# EasyEDA schematic display_board_schematic.json
TITLE: Sheet_1; REV: 1.0; Date: 2021-11-24; Sheet: 1/1; Drawn By: Gustavo Moraes; Company: Your Company
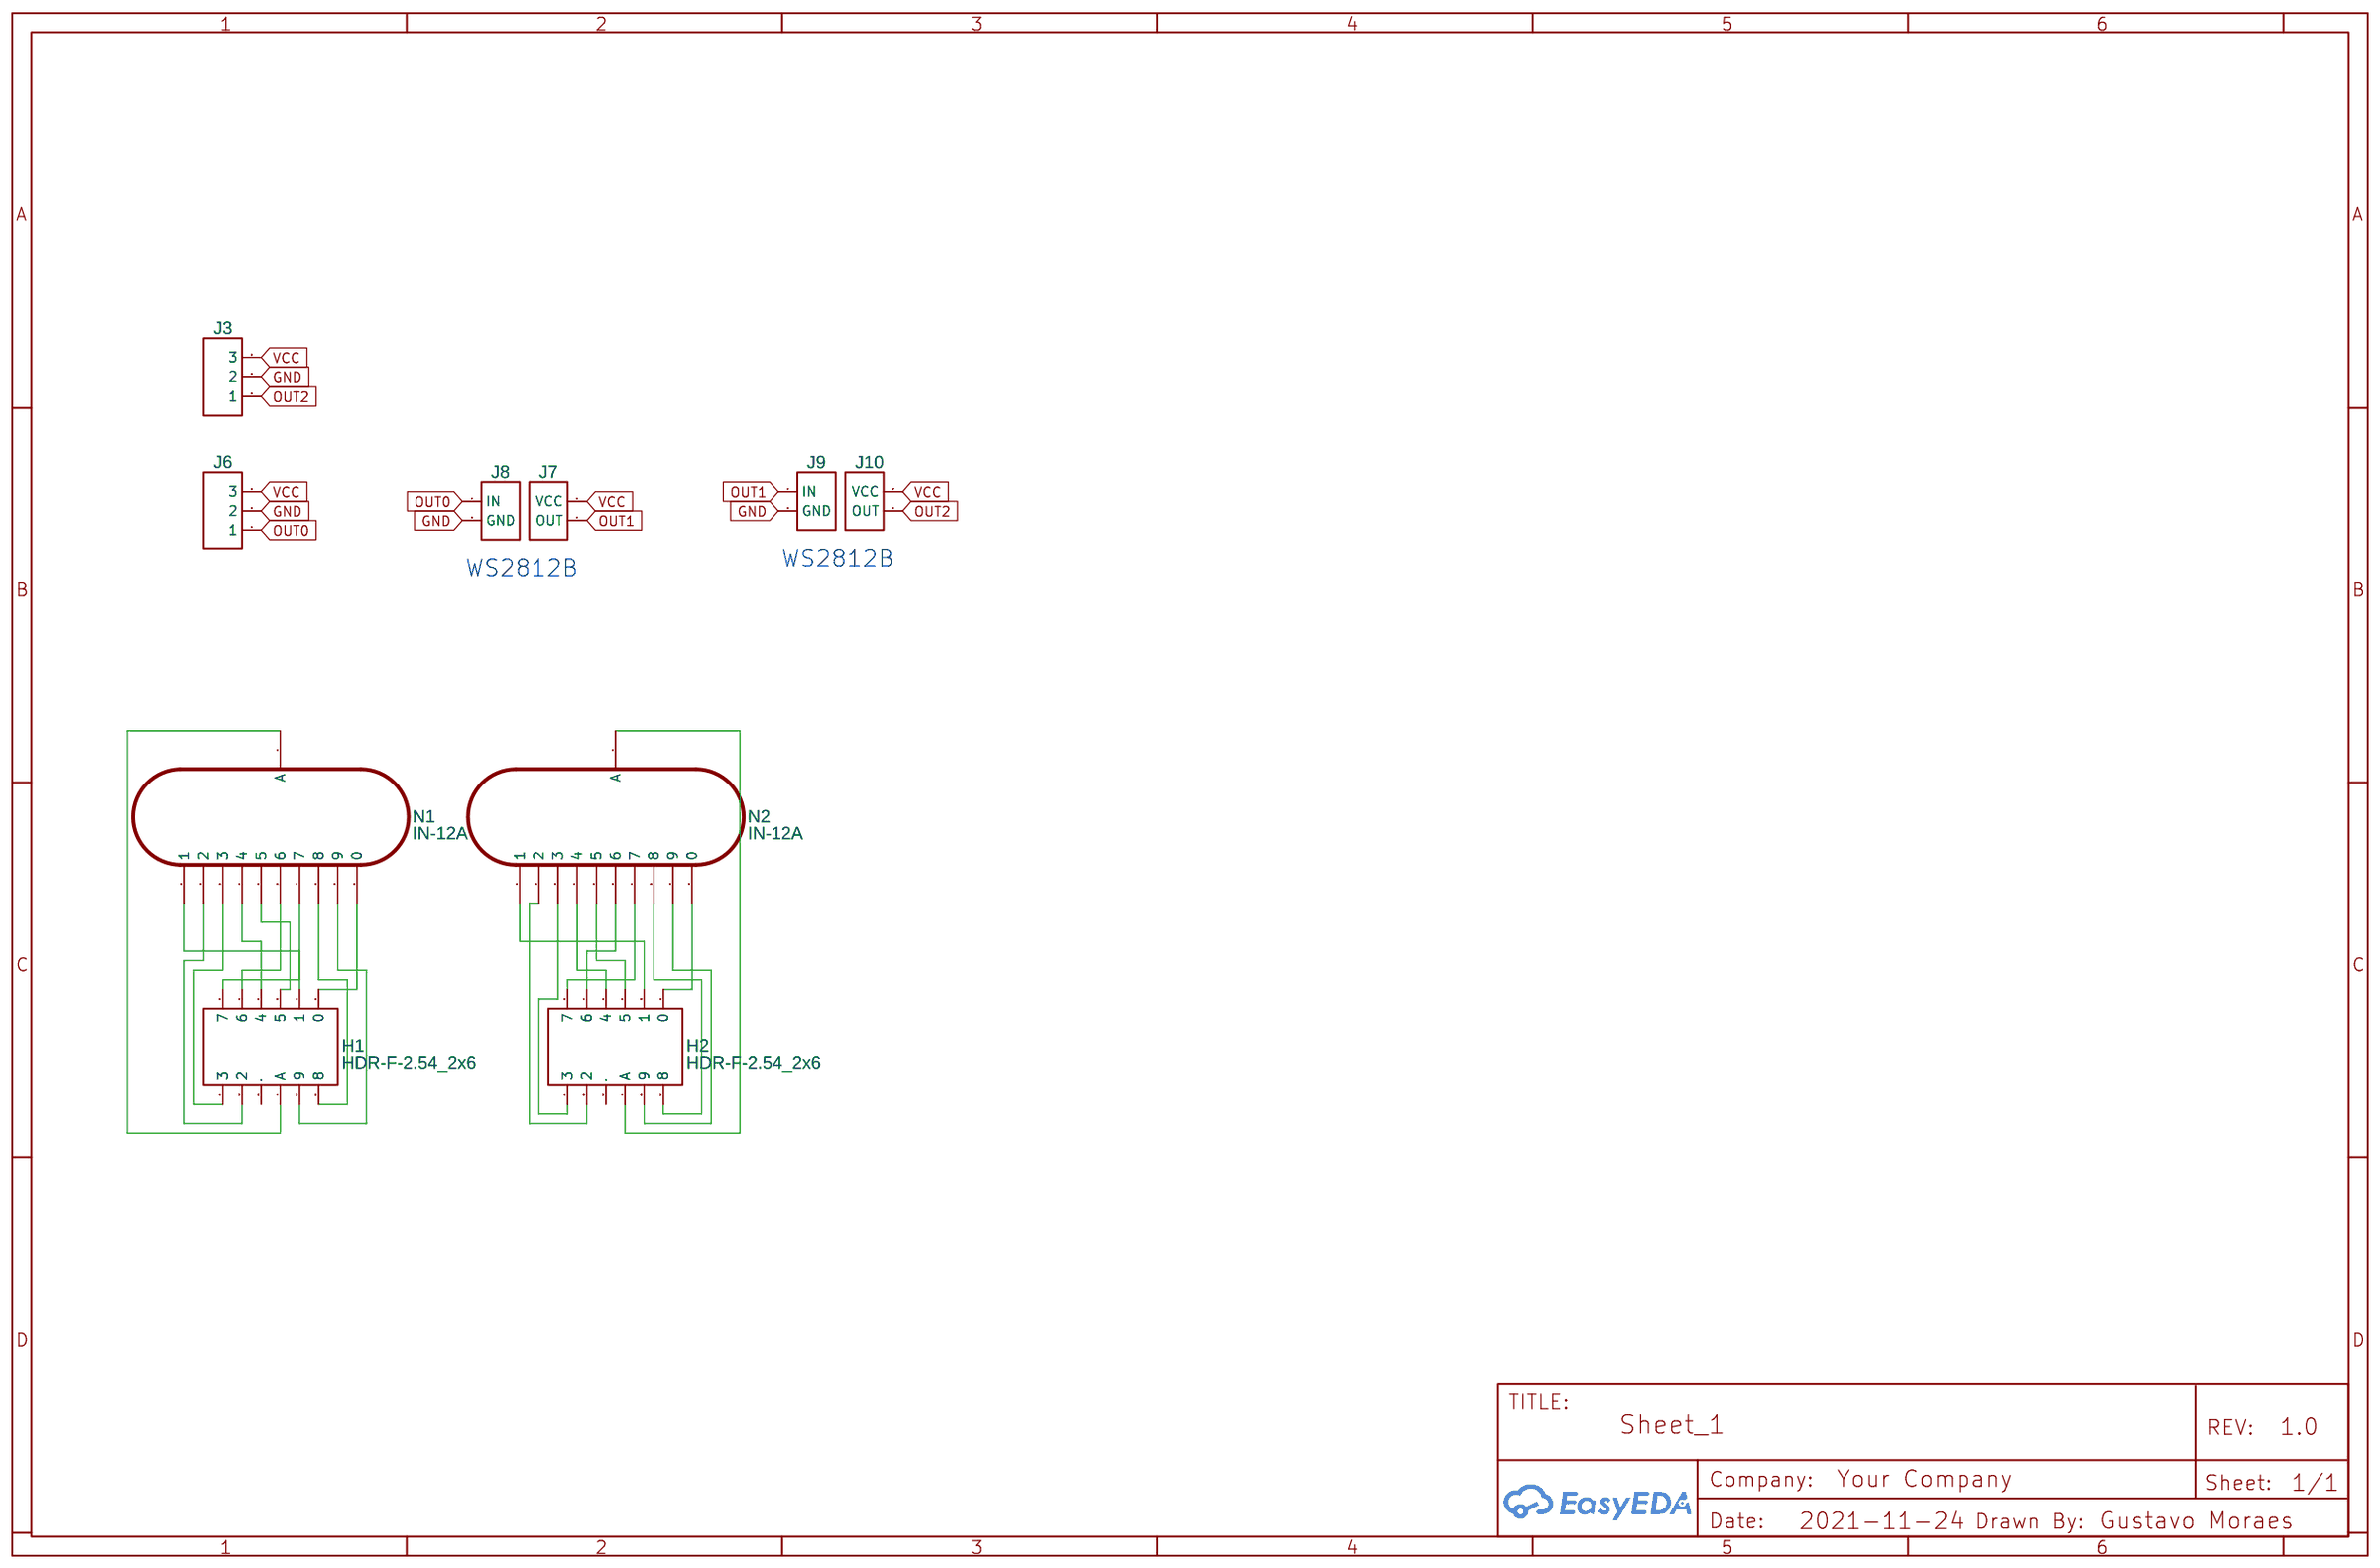
[diagram p0: schematic sheet]

## Parts
H1  HDR-F-2.54_2x6  [HDR-F-2.54_2X6]
H2  HDR-F-2.54_2x6  [HDR-F-2.54_2X6]
J3  HDR-M-2.54_1x3  [HDR-M-2.54_1X3]
J6  HDR-M-2.54_1x3  [HDR-M-2.54_1X3]
J7  HDR-M-2.54_1x2  [HDR-M-2.54_1X2]
J8  HDR-M-2.54_1x2  [HDR-M-2.54_1X2]
J9  HDR-M-2.54_1x2  [HDR-M-2.54_1X2]
J10  HDR-M-2.54_1x2  [HDR-M-2.54_1X2]
N1  IN-12A  [IN-12]
N2  IN-12A  [IN-12]

## Library data of the parts
H1 H2 = HDR-F-2.54_2x6: Supplier Part: C36191; Supplier: LCSC; Contributor: LCEDA_Lib
J3 J6 = HDR-M-2.54_1x3: Supplier Part: C180248; Supplier: LCSC; Contributor: LCEDA_Lib
J7-J10 = HDR-M-2.54_1x2: Supplier Part: C124375; Supplier: LCSC; Contributor: LCEDA_Lib
N1 N2 = IN-12A

## Nets
GND: J3.2 J6.2 J8.2(GND) J9.2(GND)
VCC: J3.3 J6.3 J7.2(VCC) J10.2(VCC)
OUT0: J6.1 J8.1(IN)
OUT1: J7.1(OUT) J9.1(IN)
OUT2: J3.1 J10.1(OUT)
Net-(H1-1): H1.1(3) N1.3
Net-(H1-2): H1.2(7) N1.7
Net-(H1-3): H1.3(2) N1.2
Net-(H1-4): H1.4(6) N1.6
Net-(H1-6): H1.6(4) N1.4
Net-(H1-7): H1.7(A) N1.A
Net-(H1-8): H1.8(5) N1.5
Net-(H1-9): H1.9 N1.9
Net-(H1-10): H1.10(1) N1.1
Net-(H1-11): H1.11(8) N1.8
Net-(H1-12): H1.12(0) N1.0
Net-(H2-1): H2.1(3) N2.3
Net-(H2-2): H2.2(7) N2.7
Net-(H2-3): H2.3(2) N2.2
Net-(H2-4): H2.4(6) N2.6
Net-(H2-6): H2.6(4) N2.4
Net-(H2-7): H2.7(A) N2.A
Net-(H2-8): H2.8(5) N2.5
Net-(H2-9): H2.9 N2.9
Net-(H2-10): H2.10(1) N2.1
Net-(H2-11): H2.11(8) N2.8
Net-(H2-12): H2.12(0) N2.0

Not connected (* = marked no-connect by the designer): H1 5; H2 5

## Notes on the sheet
- WS2812B
- WS2812B
